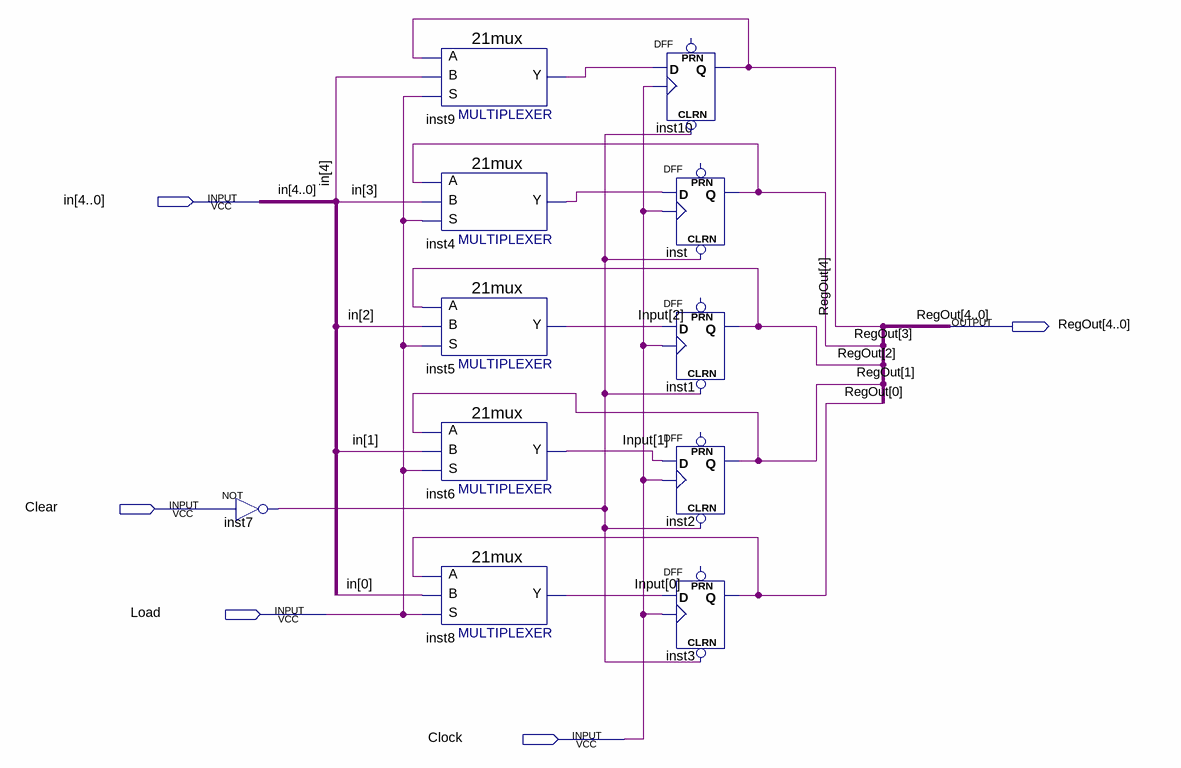
[diagram p0: schematic sheet]
// Quartus schematic Register.bdf as structural Verilog: 11 symbols, 5 pins
module Register (
  input  [4:0] in,
  input  Clear,
  input  Load,
  input  Clock,
  output [4:0] RegOut
);

  wire inst4_y, inst7_out, inst9_y;
  wire [2:0] Input;

  not inst7 (inst7_out, Clear);
  \21mux  inst9 (.S(Load), .B(in[4]), .A(RegOut[4]), .Y(inst9_y));
  \21mux  inst4 (.S(Load), .B(in[3]), .A(RegOut[3]), .Y(inst4_y));
  \21mux  inst5 (.S(Load), .B(in[2]), .A(RegOut[2]), .Y(Input[2]));
  \21mux  inst6 (.S(Load), .B(in[1]), .A(RegOut[1]), .Y(Input[1]));
  \21mux  inst8 (.S(Load), .B(in[0]), .A(RegOut[0]), .Y(Input[0]));
  DFF inst10 (.CLRN(inst7_out), .CLK(Clock), .D(inst9_y), .Q(RegOut[4]));  // open: PRN
  DFF inst (.CLRN(inst7_out), .CLK(Clock), .D(inst4_y), .Q(RegOut[3]));  // open: PRN
  DFF inst1 (.CLRN(inst7_out), .CLK(Clock), .D(Input[2]), .Q(RegOut[2]));  // open: PRN
  DFF inst2 (.CLRN(inst7_out), .CLK(Clock), .D(Input[1]), .Q(RegOut[1]));  // open: PRN
  DFF inst3 (.CLRN(inst7_out), .CLK(Clock), .D(Input[0]), .Q(RegOut[0]));  // open: PRN
endmodule
